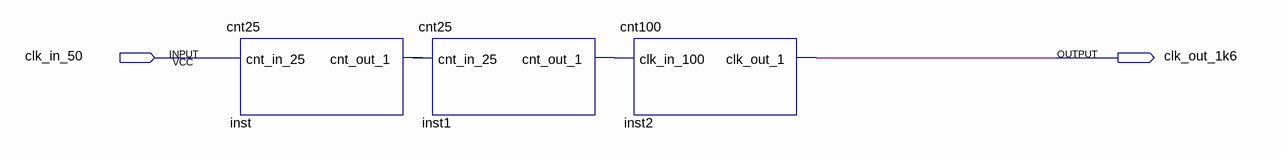
[diagram p0: schematic sheet]
// Quartus schematic mxh2.bdf as structural Verilog: 3 symbols, 2 pins
module mxh2 (
  input  clk_in_50,
  output clk_out_1k6
);

  wire inst1_cnt_out_1;

  cnt25 inst (.cnt_in_25(clk_in_50));  // open: cnt_out_1
  cnt25 inst1 (.cnt_out_1(inst1_cnt_out_1));  // open: cnt_in_25
  cnt100 inst2 (.clk_in_100(inst1_cnt_out_1), .clk_out_1(clk_out_1k6));
endmodule
